# EAGLE design test-and-programmer-v1 (EAGLE 7.5.0)
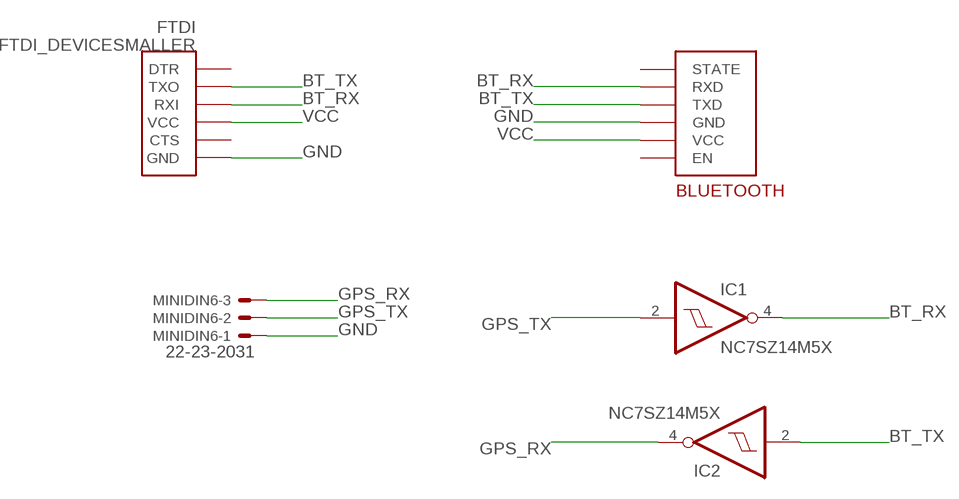
[diagram p0: schematic, sheet 1]

## Parts
BLUETOOTH  JY-MCU-BLUETOOTHHORIZONTAL  [JY-MCU-BLUETOOTH-HORIZONTAL]
FTDI  FTDI_DEVICESMALLER  [FTDI_DEVICE_SIDE_SMALLER]
IC1  NC7SZ14M5X  [SOT23-5]
IC2  NC7SZ14M5X  [SOT23-5]
MINIDIN6  22-23-2031  [22-23-2031]

## Nets
BT_RX: BLUETOOTH.RXD FTDI.P$3(RXI) IC1.4(O)
BT_TX: BLUETOOTH.TXD FTDI.P$2(TXO) IC2.2(I)
GND: BLUETOOTH.GND FTDI.P$6(GND) MINIDIN6.1
GPS_RX: IC2.4(O) MINIDIN6.3
GPS_TX: IC1.2(I) MINIDIN6.2
VCC: BLUETOOTH.VCC FTDI.P$4(VCC)
Unconnected: BLUETOOTH.EN BLUETOOTH.STATE FTDI.P$1(DTR) FTDI.P$5(CTS)

## Power pins joined to a net without a drawn wire
GND: IC1.3(GND) IC2.3(GND)
VCC: IC1.5(VCC) IC2.5(VCC)

## Library data of the parts
BLUETOOTH = kalanda:JY-MCU-BLUETOOTH
FTDI = kalanda:FTDI_DEVICE: Connector which mates to FTDI basic or FTDI cable.
IC1 IC2 = 74xx-little-us:NC7SZ14: TinyLogic(R) UHS Inverter with Schmitt Trigger Input Source: http://www.fairchildsemi.com/ds/NC/NC7SZ14.pdf
MINIDIN6 = con-molex:22-23-2031: .100" (2.54mm) Center Header - 3 Pin; MF: MOLEX; MPN: 22-23-2031; OC_FARNELL: 1462950; OC_NEWARK: 30C0862

## Board
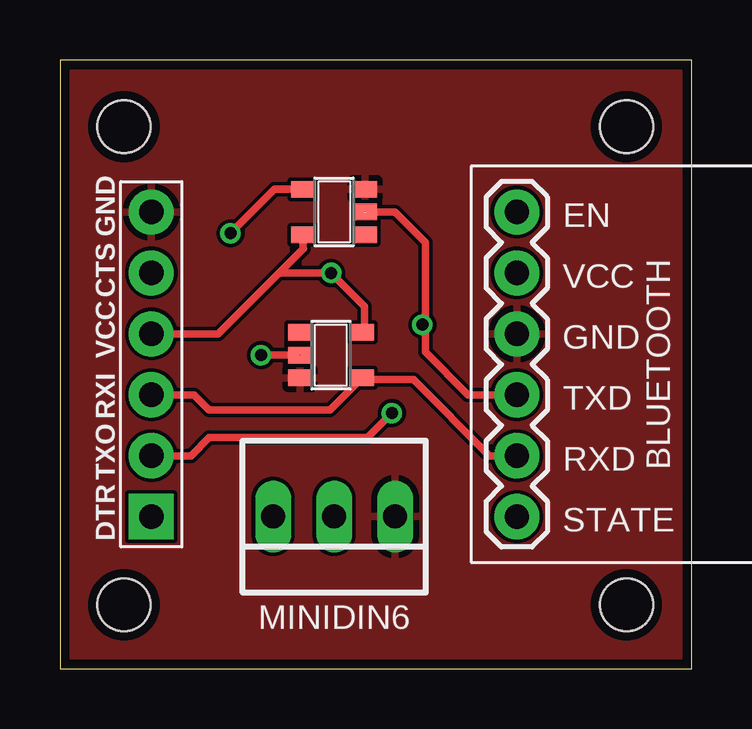
[diagram p1: board, top side]
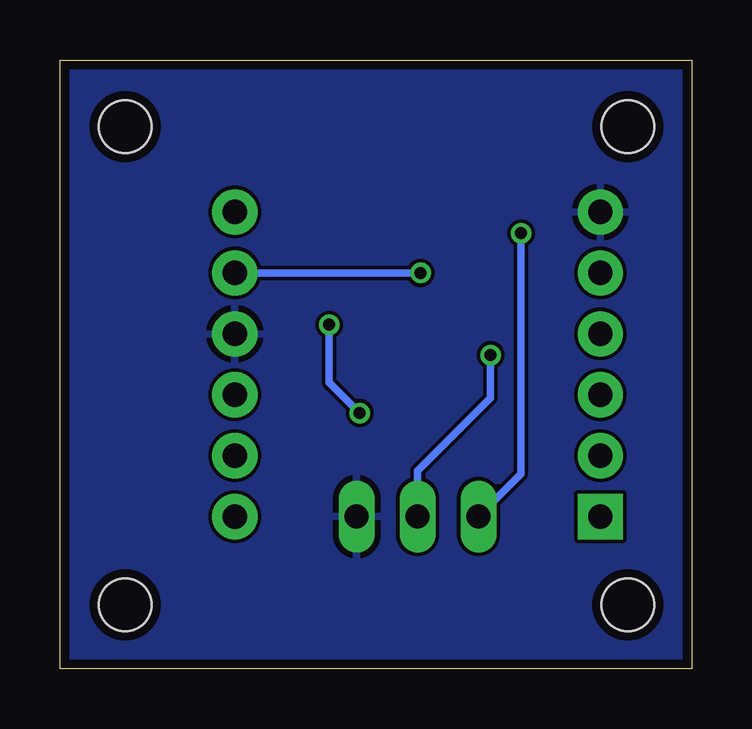
[diagram p2: board, bottom side, seen from below]

Size 26.34 x 25.39 mm. Coordinates in mm from the lower left corner, seen from the top.
Outline: 0,0 26.34,0 26.34,25.39 0,25.39 0,0
Copper layers (1*16): Top 0.0356mm / dielectric 1.5011mm / Bottom 0.0356mm
Design rules "LaenPCBOrder_without_tentedvias": minimum track width 6mil, minimum drill 13mil, track to track 6mil, track to pad 6mil, pad to pad 6mil, via to via 6mil, smd to smd 6mil, copper to edge 15mil, drill to drill 6mil, minimum pad ring 7mil, minimum via ring 7mil, stop-mask expansion 3mil, vias tented up to drill 30mil, thermal gap 10mil
Holes 2.2 mm at 2.67,22.61 2.67,2.67 23.62,2.67 23.62,22.61

### Footprints (pad centres in the part's own frame; a part is rotated, then mirrored left to right if it is on the bottom)
JY-MCU-BLUETOOTH-HORIZONTAL = drill 1.016 pad 1.88: EN 0,0; GND 5.08,0; RXD 10.16,0; STATE 12.7,0; TXD 7.62,0; VCC 2.54,0
FTDI_DEVICE_SIDE_SMALLER = drill 1.016 pad 1.88 square: P$1 -6.35,0 | drill 1.016 pad 1.88: P$2 -3.81,0; P$3 -1.27,0; P$4 1.27,0; P$5 3.81,0; P$6 6.35,0
SOT23-5 = smd 0.69 x 0.99: 1 -0.95,-1.29; 2 0,-1.29; 3 0.95,-1.29; 4 0.95,1.3; 5 -0.95,1.3
22-23-2031 = drill 1 long: 1 -2.54,0; 2 0,0; 3 2.54,0

### Placement (x,y rotation side)
BLUETOOTH  19.05,19.05 270 top
FTDI  3.81,12.7 90 top
IC1  11.3,13.08 270 top
IC2  11.43,19.05 90 top
MINIDIN6  11.43,6.35 180 top

### Tracks (layer width: path | path; a pad name or v marks a point on that pad's centre or on a via)
BT_RX
  Top 0.305: BLUETOOTH.RXD 17.91,8.89 14.73,12.06 12.67,12.06 IC1.4 11.27,10.79 6.22,10.79 5.59,11.43 FTDI.P$3
BT_TX  (via drill 0.5)
  Top 0.305: BLUETOOTH.TXD 17.02,11.43 15.24,13.21 15.24,14.35 | 15.24,14.35 15.24,17.78 13.97,19.05 IC2.2 | FTDI.P$2 5.46,8.89 6.22,9.65 12.83,9.65 v13.84,10.67 | v15.11,14.35 15.24,14.35
  Bottom 0.305: v13.84,10.67 15.11,11.94 v15.11,14.35
GND
  pour Bottom: 0.13,25.4 26.29,25.4 26.29,0 0.13,0
  pour Top: 0,25.27 26.29,25.27 26.29,0 0,0
GPS_RX  (via drill 0.5)
  Top 0.305: IC2.4 8.95,20 v7.11,18.16
  Bottom 0.305: v7.11,18.16 7.11,8.13 MINIDIN6.3
GPS_TX  (via drill 0.5)
  Top 0.305: v8.38,13.08 IC1.2
  Bottom 0.305: MINIDIN6.2 11.43,8.26 8.38,11.3 v8.38,13.08
VCC  (via drill 0.5)
  Top 0.305: IC1.5 12.7,14.13 12.7,15.11 v11.3,16.51 9.14,16.51 | IC2.5 10.13,17.56 10.16,17.53 9.14,16.51 | FTDI.P$4 6.6,13.97 9.14,16.51
  Bottom 0.305: BLUETOOTH.VCC v11.3,16.51